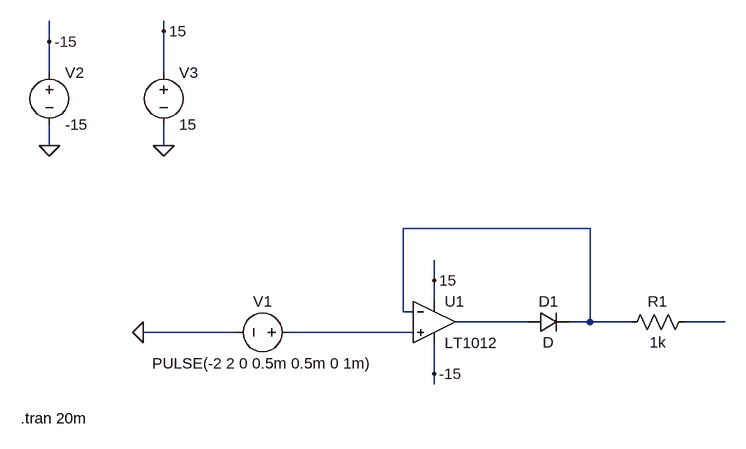
[diagram p0: schematic SuperDiode.asc]
SuperDiode.asc, the LTspice schematic file:
Version 4
SHEET 1 880 680
WIRE -368 -272 -368 -288
WIRE -544 -256 -544 -288
WIRE -544 -208 -544 -256
WIRE -368 -208 -368 -272
WIRE -544 -96 -544 -128
WIRE -368 -96 -368 -128
WIRE 288 32 0 32
WIRE 48 112 48 80
WIRE 48 144 48 112
WIRE 0 160 0 32
WIRE 16 160 0 160
WIRE 192 176 80 176
WIRE 288 176 288 32
WIRE 288 176 256 176
WIRE 352 176 288 176
WIRE 496 176 432 176
WIRE -256 192 -400 192
WIRE 16 192 -176 192
WIRE 48 256 48 208
WIRE 48 272 48 256
FLAG -400 192 0
FLAG -544 -96 0
FLAG -368 -96 0
FLAG -368 -272 15
FLAG -544 -256 -15
FLAG 48 112 15
FLAG 48 256 -15
SYMBOL voltage -160 192 R90
WINDOW 0 -32 56 VBottom 2
WINDOW 3 32 56 VTop 2
WINDOW 123 0 0 Left 2
WINDOW 39 0 0 Left 2
SYMATTR InstName V1
SYMATTR Value PULSE(-2 2 0 0.5m 0.5m 0 1m)
SYMBOL Opamps\\LT1012 48 112 R0
SYMATTR InstName U1
SYMBOL diode 192 160 M90
WINDOW 0 0 32 VBottom 2
WINDOW 3 32 32 VTop 2
SYMATTR InstName D1
SYMBOL res 448 160 R90
WINDOW 0 0 56 VBottom 2
WINDOW 3 32 56 VTop 2
SYMATTR InstName R1
SYMATTR Value 1k
SYMBOL voltage -544 -224 R0
WINDOW 123 0 0 Left 2
WINDOW 39 0 0 Left 2
SYMATTR InstName V2
SYMATTR Value -15
SYMBOL voltage -368 -224 R0
WINDOW 123 0 0 Left 2
WINDOW 39 0 0 Left 2
SYMATTR InstName V3
SYMATTR Value 15
TEXT -588 324 Left 2 !.tran 20m

The netlist it stands for:
* SuperDiode.asc
V1 N004 0 PULSE(-2 2 0 0.5m 0.5m 0 1m)
XU1 N004 N001 15 -15 N002 LT1012  ; pins In+ In- V+ V- OUT
D1 N002 N001 D
R1 N003 N001 1k
V2 -15 0 -15
V3 15 0 15
.model D D
.lib standard.dio
.tran 20m
.backanno
.end